# Altium schematic sheet RF_Attenuator.SchDoc: =Project
size 420 x 297 mm; Author: G.Kasprowicz; CompanyName: WUT ISE; DrawnBy: G.Kasprowicz; Organization: WUT ISE; Address1: PW ISE; Address2: Nowowiejska 15/19 00-665 Warsaw; Address3: gkasprow@gmail.com; SheetNumber: -; SheetTotal: -; ModifiedBy: -; CheckedDate: -; Title2: Top; DivGrp: WUT ISE; Designer: G.Kasprowicz; SPICEModelCacheRYPVXPCY: <root> / <DocumentId>RYPVXPCY</DocumentId> / </root>; ModifiedDate: -; ProjectName: Sensor Box
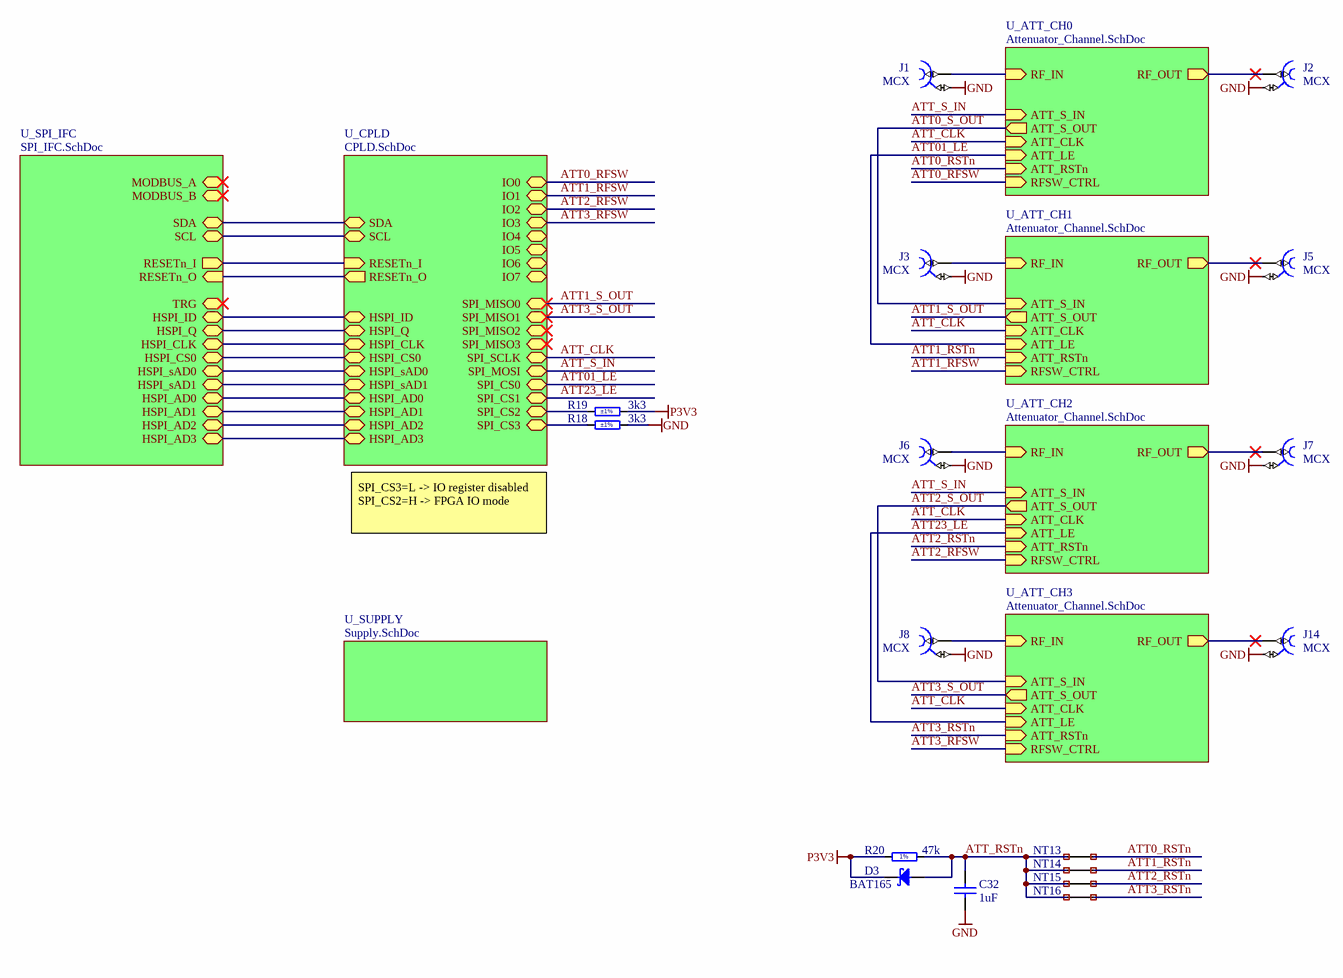
[diagram p0: RF_Attenuator.SchDoc]

## Parts
C32  1uF  [CAPC1005X55N]
D3  BAT165  [SOD2512X110N]
J1  MCX  [AMPHENOL_919-109J-51PX]
J2  MCX  [AMPHENOL_919-109J-51PX]
J3  MCX  [AMPHENOL_919-109J-51PX]
J5  MCX  [AMPHENOL_919-109J-51PX]
J6  MCX  [AMPHENOL_919-109J-51PX]
J7  MCX  [AMPHENOL_919-109J-51PX]
J8  MCX  [AMPHENOL_919-109J-51PX]
J14  MCX  [AMPHENOL_919-109J-51PX]
NT13  Net Tie  [Net Tie 3]  (value not drawn)  (net tie, no BOM)
NT14  Net Tie  [Net Tie 3]  (value not drawn)  (net tie, no BOM)
NT15  Net Tie  [Net Tie 3]  (value not drawn)  (net tie, no BOM)
NT16  Net Tie  [Net Tie 3]  (value not drawn)  (net tie, no BOM)
R18  3k3  Tolerance: ±1%  [RESC1005X40N]
R19  3k3  Tolerance: ±1%  [RESC1005X40N]
R20  47k  [RESC1005X40N]

## Sub-sheets
U_ATT_CH0 = Attenuator_Channel.SchDoc: ATT_LE (in), RF_IN (in), RF_OUT (out), ATT_S_OUT (out), ATT_CLK (in), ATT_RSTn (in), ATT_S_IN (in), RFSW_CTRL (in)
U_ATT_CH1 = Attenuator_Channel.SchDoc: ATT_LE (in), RF_IN (in), RF_OUT (out), ATT_S_OUT (out), ATT_CLK (in), ATT_RSTn (in), ATT_S_IN (in), RFSW_CTRL (in)
U_ATT_CH2 = Attenuator_Channel.SchDoc: ATT_LE (in), RF_IN (in), RF_OUT (out), ATT_S_OUT (out), ATT_CLK (in), ATT_RSTn (in), ATT_S_IN (in), RFSW_CTRL (in)
U_ATT_CH3 = Attenuator_Channel.SchDoc: ATT_LE (in), RF_IN (in), RF_OUT (out), ATT_S_OUT (out), ATT_CLK (in), ATT_RSTn (in), ATT_S_IN (in), RFSW_CTRL (in)
U_CPLD = CPLD.SchDoc: SDA (bidir), SCL (bidir), RESETn_I (in), RESETn_O (out), HSPI_ID (bidir), HSPI_Q (bidir), HSPI_CLK (bidir), HSPI_CS0 (bidir), HSPI_sAD0 (bidir), HSPI_sAD1 (bidir), HSPI_AD0 (bidir), HSPI_AD1 (bidir), HSPI_AD2 (bidir), HSPI_AD3 (bidir), IO5 (bidir), IO0 (bidir), IO1 (bidir), SPI_MISO2 (bidir), SPI_CS3 (bidir), SPI_CS1 (bidir), SPI_SCLK (bidir), IO4 (bidir), SPI_MISO3 (bidir), IO3 (bidir), SPI_MISO0 (bidir), SPI_CS0 (bidir), SPI_MOSI (bidir), SPI_CS2 (bidir), IO2 (bidir), IO7 (bidir), SPI_MISO1 (bidir), IO6 (bidir)
U_SPI_IFC = SPI_IFC.SchDoc: TRG (bidir), SCL (bidir), RESETn_O (in), MODBUS_A (bidir), HSPI_AD3 (bidir), MODBUS_B (bidir), RESETn_I (out), SDA (bidir), HSPI_CLK (bidir), HSPI_Q (bidir), HSPI_sAD0 (bidir), HSPI_ID (bidir), HSPI_AD2 (bidir), HSPI_CS0 (bidir), HSPI_AD1 (bidir), HSPI_sAD1 (bidir), HSPI_AD0 (bidir)
U_SUPPLY = Supply.SchDoc: no entries

## Nets
GND: C32.1 J1.2 J2.2 J3.2 J5.2 J6.2 J7.2 J8.2 J14.2 R18.2
P3V3: D3.1(C) R19.2 R20.1
ATT0_RFSW: sheet U_ATT_CH0/RFSW_CTRL, sheet U_CPLD/IO0
ATT0_RSTn: NT13.2 ; sheet U_ATT_CH0/ATT_RSTn
ATT0_S_OUT: sheet U_ATT_CH0/ATT_S_OUT, sheet U_ATT_CH1/ATT_S_IN
ATT01_LE: sheet U_ATT_CH0/ATT_LE, sheet U_ATT_CH1/ATT_LE, sheet U_CPLD/SPI_CS0
ATT1_RFSW: sheet U_ATT_CH1/RFSW_CTRL, sheet U_CPLD/IO1
ATT1_RSTn: NT14.2 ; sheet U_ATT_CH1/ATT_RSTn
ATT1_S_OUT: sheet U_ATT_CH1/ATT_S_OUT, sheet U_CPLD/SPI_MISO0
ATT2_RFSW: sheet U_ATT_CH2/RFSW_CTRL, sheet U_CPLD/IO2
ATT2_RSTn: NT15.2 ; sheet U_ATT_CH2/ATT_RSTn
ATT2_S_OUT: sheet U_ATT_CH2/ATT_S_OUT, sheet U_ATT_CH3/ATT_S_IN
ATT3_RFSW: sheet U_ATT_CH3/RFSW_CTRL, sheet U_CPLD/IO3
ATT3_RSTn: NT16.2 ; sheet U_ATT_CH3/ATT_RSTn
ATT3_S_OUT: sheet U_ATT_CH3/ATT_S_OUT, sheet U_CPLD/SPI_MISO1
ATT23_LE: sheet U_ATT_CH2/ATT_LE, sheet U_ATT_CH3/ATT_LE, sheet U_CPLD/SPI_CS1
ATT_CLK: sheet U_ATT_CH0/ATT_CLK, sheet U_ATT_CH1/ATT_CLK, sheet U_ATT_CH2/ATT_CLK, sheet U_ATT_CH3/ATT_CLK, sheet U_CPLD/SPI_SCLK
ATT_RSTn: C32.2 D3.2(A) NT13.1 NT14.1 NT15.1 NT16.1 R20.2
ATT_S_IN: sheet U_ATT_CH0/ATT_S_IN, sheet U_ATT_CH2/ATT_S_IN, sheet U_CPLD/SPI_MOSI
NetJ1_1: J1.1 ; sheet U_ATT_CH0/RF_IN
NetJ2_1: J2.1 ; sheet U_ATT_CH0/RF_OUT
NetJ3_1: J3.1 ; sheet U_ATT_CH1/RF_IN
NetJ5_1: J5.1 ; sheet U_ATT_CH1/RF_OUT
NetJ6_1: J6.1 ; sheet U_ATT_CH2/RF_IN
NetJ7_1: J7.1 ; sheet U_ATT_CH2/RF_OUT
NetJ8_1: J8.1 ; sheet U_ATT_CH3/RF_IN
NetJ14_1: J14.1 ; sheet U_ATT_CH3/RF_OUT
NetR18_1: R18.1 ; sheet U_CPLD/SPI_CS3
NetR19_1: R19.1 ; sheet U_CPLD/SPI_CS2
(unnamed): sheet U_SPI_IFC/SCL, sheet U_CPLD/SCL
(unnamed): sheet U_SPI_IFC/RESETn_O, sheet U_CPLD/RESETn_O
(unnamed): sheet U_SPI_IFC/HSPI_AD3, sheet U_CPLD/HSPI_AD3
(unnamed): sheet U_SPI_IFC/RESETn_I, sheet U_CPLD/RESETn_I
(unnamed): sheet U_SPI_IFC/SDA, sheet U_CPLD/SDA
(unnamed): sheet U_SPI_IFC/HSPI_CLK, sheet U_CPLD/HSPI_CLK
(unnamed): sheet U_SPI_IFC/HSPI_Q, sheet U_CPLD/HSPI_Q
(unnamed): sheet U_SPI_IFC/HSPI_sAD0, sheet U_CPLD/HSPI_sAD0
(unnamed): sheet U_SPI_IFC/HSPI_ID, sheet U_CPLD/HSPI_ID
(unnamed): sheet U_SPI_IFC/HSPI_AD2, sheet U_CPLD/HSPI_AD2
(unnamed): sheet U_SPI_IFC/HSPI_CS0, sheet U_CPLD/HSPI_CS0
(unnamed): sheet U_SPI_IFC/HSPI_AD1, sheet U_CPLD/HSPI_AD1
(unnamed): sheet U_SPI_IFC/HSPI_sAD1, sheet U_CPLD/HSPI_sAD1
(unnamed): sheet U_SPI_IFC/HSPI_AD0, sheet U_CPLD/HSPI_AD0

## Notes on the sheet
- SPI_CS3=L -> IO register disabled
  SPI_CS2=H -> FPGA IO mode
- Project/Equipment
- Document
- Designer
- Drawn by
- Check.by
- Copyright WUT ISE 2018.
  This documentation describes Open Hardware and is licensed under the CERN OHL v.1.1. You may redistribute and modify this documentation under the terms of the CERN OHL v.1.1. (http://ohwr.org/CERNOHL). This documentation is distributed WITHOUT ANY EXPRESS OR IMPLIED WARRANTY, INCLUDING OF MERCHANTABILITY, SATISFACTORY QUALITY AND FITNESS FOR A PARTICULAR PURPOSE. Please see the CERN OHL v.1.1 for applicable conditions.
- Contact
- File
- Last Mod.
- Print Date
- Sheet
- Size
- A3
- of
- Rev
- (in symbol R0402_47K_1%_0.0625W_100PPM) 1%

## Library data of the parts
C32 = CC0402_1UF_16V_10%_X5R: Non-polarised capacitor; Part Description: SMD Multilayer Chip Ceramic Capacitor; Manufacturer: GENERIC; Manufacturer1 Part Number: C1005X5R1C105KT; Voltage: 16V; TC: X5R; Tolerance: ±10%; Part Number: CC0402_1UF_16V_10%_X5R; Component Kind: Standard; Component Type: Standard; Pin Count: 2; Value: 1uF; Status: Preferred; Manufacturer Part Number: CC0402_1UF_16V_10%_X5R; Case: 0402; Mounted: Yes; Socket: No; SMD: Yes; Sense: No; Manufacturer1 Example: TDK; Manufacturer1 ComponentHeight: 0.55mm; HelpURL: \\cern.ch\dfs\Applications\Altium\Datasheets\CC0402_X5R_TDK_C.pdf; Author: CERN DEM JLC; CreateDate: 25.10.2012; LatestRevisionDate: 25.10.2012
D3 = BAT165: Schottky Diode; Part Description: Medium Power AF Schottky Diode; Manufacturer: INFINEON; Voltage: 40V; Power: 750mA; PressFit: No; Bonding: No; Part Number: BAT165; Component Kind: Standard; Component Type: Standard; Device: BAT165; PackageDescription: Small Outline Diode (SOD-323), 1.70mm W X 1.25mm L X 1.10mm H body,  IPC Medium Density; Manufacturer Part Number: BAT165; Pin Count: 2; Case: SOD-323; Mounted: Yes; Socket: No; SMD: Yes; Sense: No; ComponentHeight: 1.1mm; HelpURL: \\cern.ch\dfs\Applications\Altium\Datasheets\BAT165.pdf; Author: CERN DEM JLC; CreateDate: 12.11.2014; LatestRevisionDate: 12.11.2014
J1-J3 J5-J8 J14 = AMPHENOL_919-109J-51PX: Part Description: 50 Ohms, RF Connector, MCX Straight PCB Receptacle Jack; Manufacturer Part Number: 919-109J-51PX (MCX6251B1-3GT30G-50); PressFit: No; Part Number: AMPHENOL_919-109J-51PX; Component Kind: Standard; Component Type: Standard; Pin Count: 5; Family: MCX; Mounted: Yes; Socket: No; SMD: No; Sense: No; Status: None; Manufacturer: AMPHENOL; ComponentHeight: 6.06mm; HelpURL: \\cern.ch\dfs\Applications\Altium\Datasheets\AMPHENOL_919-109J-51PX.pdf; Author: CERN DEM BC; CreateDate: 31.01.2019; LatestRevisionDate: 31.01.2019
NT13-NT16 = Net Tie 3: Part Description: Net Tie (2 Nets); Mounted: No; Part Number: Net Tie 3; Component Type: Net Tie; Pin Count: 2; Family: Net Tie; Socket: No; SMD: No; Sense: No; Status: None; ComponentHeight: 0mm; HelpURL: Undefined; Author: CERN DEM HF; CreateDate: 23.09.2024; LatestRevisionDate: 23.09.2024; PackageDescription: SMD Net Tie
R18 R19 = R0402_3K3_1%_0.0625W_100PPM: Resistor - 1%; Part Description: General Purpose Thick Film Chip Resistor; Manufacturer: GENERIC; Manufacturer1 Part Number: 232270673302L; TC: ±100ppm/°C; PressFit: No; Part Number: R0402_3K3_1%_0.0625W_100PPM; Component Kind: Standard; Component Type: Standard; Pin Count: 2; Value: 3k3; Status: Not Recommended; Power: 0.0625W; Manufacturer Part Number: R0402_3K3_1%_0.0625W_100PPM; Case: 0402; Mounted: Yes; Sense: No; Socket: No; SMD: Yes; Manufacturer1 Example: YAGEO PHYCOMP; Manufacturer1 ComponentHeight: 0.4mm; HelpURL: \\cern.ch\dfs\Applications\Altium\Datasheets\R0402_Phycomp_RC0402.pdf; Author: CERN DEM JLC; CreateDate: 03.12.2007; LatestRevisionDate: 17.10.2012
R20 = R0402_47K_1%_0.0625W_100PPM: Resistor - 1%; Part Description: General Purpose Thick Film Chip Resistor; Manufacturer: GENERIC; Manufacturer1 Part Number: 232270675103L; TC: ±100ppm/°C; PressFit: No; Part Number: R0402_47K_1%_0.0625W_100PPM; Component Kind: Standard; Component Type: Standard; Pin Count: 2; Value: 47k; Status: Not Recommended; Power: 0.0625W; Tolerance: ±1%; Manufacturer Part Number: R0402_47K_1%_0.0625W_100PPM; Case: 0402; Mounted: Yes; Sense: No; Socket: No; SMD: Yes; Manufacturer1 Example: YAGEO PHYCOMP; Manufacturer1 ComponentHeight: 0.4mm; HelpURL: \\cern.ch\dfs\Applications\Altium\Datasheets\R0402_Phycomp_RC0402.pdf; Author: CERN DEM JLC; CreateDate: 03/12/2007; LatestRevisionDate: 17/10/2012